# Altium schematic sheet mdriver.SchDoc: VNH5050 Motor Driver Circuit
size A4; ApprovedBy: Vincent Cayadi; CheckedBy: Vincent Cayadi; Author: Vincent Cayadi; CompanyName: Hwa Chong Institution; DrawnBy: Vincent Cayadi; Engineer: Vincent Cayadi; Organization: Sentinels Robotics; SheetNumber: 3; SheetTotal: 3
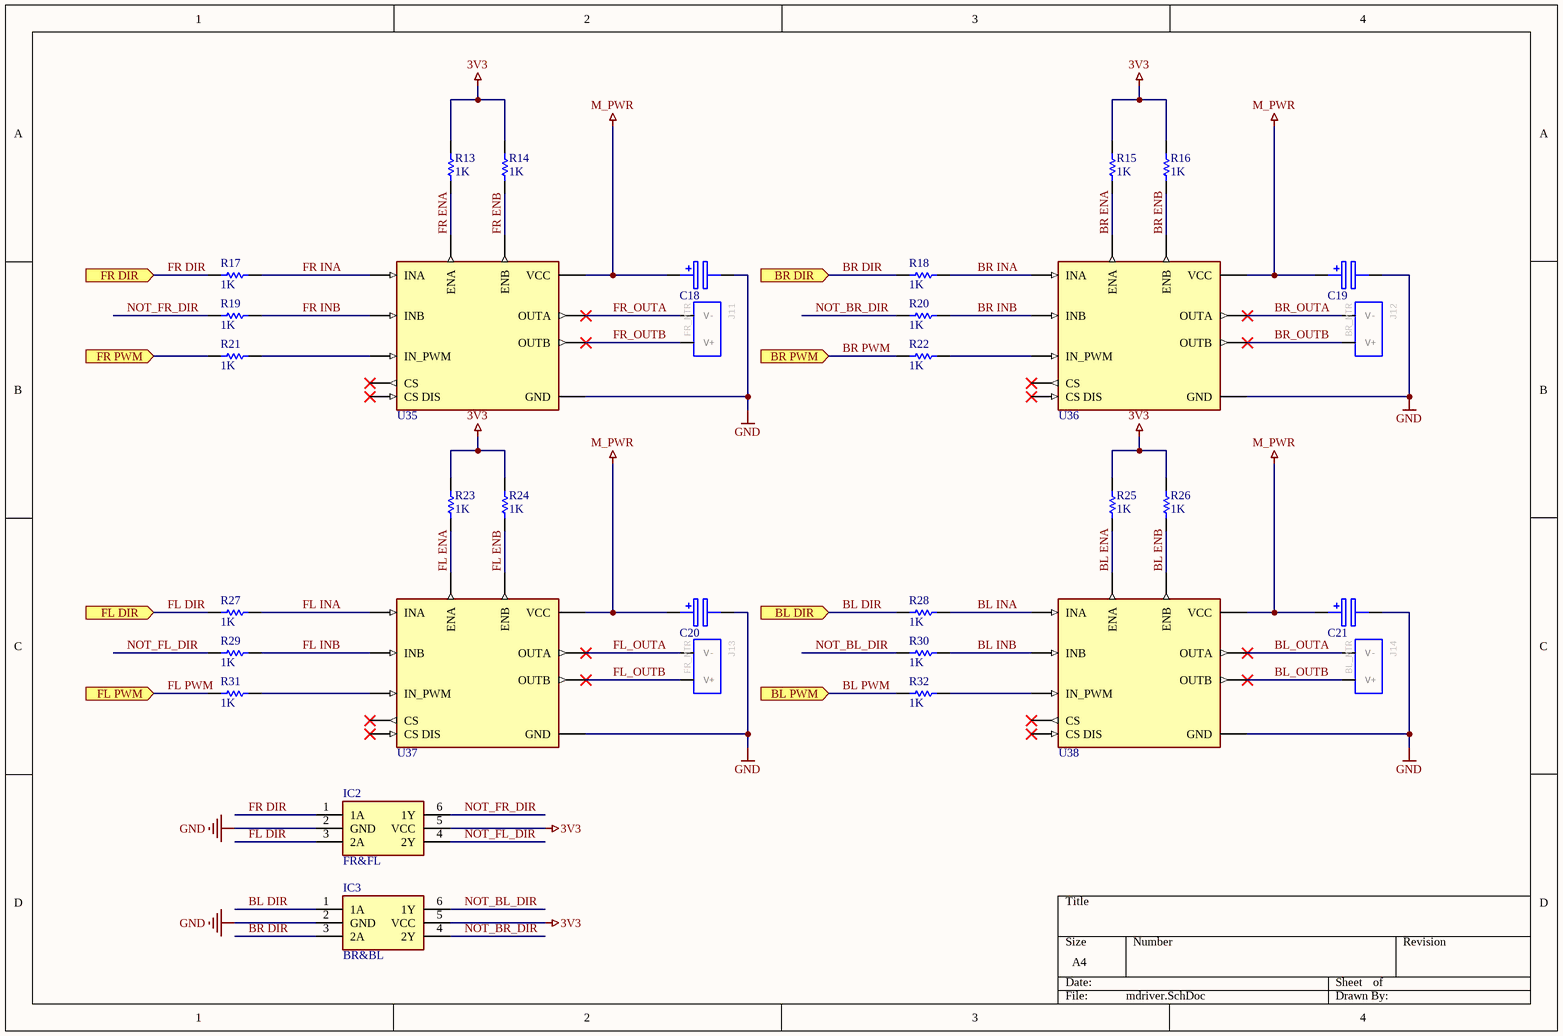
[diagram p0: mdriver.SchDoc]

## Parts
C18  47u  [EEE0JA331XP]  (value not drawn)
C19  47u  [EEE0JA331XP]  (value not drawn)
C20  47u  [EEE0JA331XP]  (value not drawn)
C21  47u  [EEE0JA331XP]  (value not drawn)
IC2  FR&FL  [SOT-23-6]
IC3  BR&BL  [SOT-23-6]
J11  FR_MTR  [XT30PB-F]
J12  BR_MTR  [XT30PB-F]
J13  FR_MTR  [XT30PB-F]
J14  BL_MTR  [XT30PB-F]
R13  1K  [RES0603]
R14  1K  [RES0603]
R15  1K  [RES0603]
R16  1K  [RES0603]
R17  1K  [RES0603]
R18  1K  [RES0603]
R19  1K  [RES0603]
R20  1K  [RES0603]
R21  1K  [RES0603]
R22  1K  [RES0603]
R23  1K  [RES0603]
R24  1K  [RES0603]
R25  1K  [RES0603]
R26  1K  [RES0603]
R27  1K  [RES0603]
R28  1K  [RES0603]
R29  1K  [RES0603]
R30  1K  [RES0603]
R31  1K  [RES0603]
R32  1K  [RES0603]
U35  FR  [SOP50P1030X247-39N]  (value not drawn)
U36  BR  [SOP50P1030X247-39N]  (value not drawn)
U37  FL  [SOP50P1030X247-39N]  (value not drawn)
U38  BL  [SOP50P1030X247-39N]  (value not drawn)

## Ports
BL DIR (in), BL PWM (in), BR DIR (in), BR PWM (in), FL DIR (in), FL PWM (in), FR DIR (in), FR PWM (in)

## Nets
3V3: IC2.5(VCC) IC3.5(VCC) R13.2 R14.2 R15.2 R16.2 R23.2 R24.2 R25.2 R26.2
GND: C18.2(-) C19.2(-) C20.2(-) C21.2(-) IC2.2(GND) IC3.2(GND) U35.GND U36.GND U37.GND U38.GND
M_PWR: C18.1(+) C19.1(+) C20.1(+) C21.1(+) U35.39(VCC) U36.39(VCC) U37.39(VCC) U38.39(VCC)
BL DIR: IC3.1(1A) R28.2 ; port BL DIR
BL ENA: R25.1 U38.16(ENA)
BL ENB: R26.1 U38.21(ENB)
BL INA: R28.1 U38.15(INA)
BL INB: R30.1 U38.22(INB)
BL PWM: R32.2 ; port BL PWM
BL_OUTA: J14.-(V-) U38.38(OUTA)
BL_OUTB: J14.+(V+) U38.37(OUTB)
BR DIR: IC3.3(2A) R18.2 ; port BR DIR
BR ENA: R15.1 U36.16(ENA)
BR ENB: R16.1 U36.21(ENB)
BR INA: R18.1 U36.15(INA)
BR INB: R20.1 U36.22(INB)
BR PWM: R22.2 ; port BR PWM
BR_OUTA: J12.-(V-) U36.38(OUTA)
BR_OUTB: J12.+(V+) U36.37(OUTB)
FL DIR: IC2.3(2A) R27.2 ; port FL DIR
FL ENA: R23.1 U37.16(ENA)
FL ENB: R24.1 U37.21(ENB)
FL INA: R27.1 U37.15(INA)
FL INB: R29.1 U37.22(INB)
FL PWM: R31.2 ; port FL PWM
FL_OUTA: J13.-(V-) U37.38(OUTA)
FL_OUTB: J13.+(V+) U37.37(OUTB)
FR DIR: IC2.1(1A) R17.2 ; port FR DIR
FR ENA: R13.1 U35.16(ENA)
FR ENB: R14.1 U35.21(ENB)
FR INA: R17.1 U35.15(INA)
FR INB: R19.1 U35.22(INB)
FR PWM: R21.2 ; port FR PWM
FR_OUTA: J11.-(V-) U35.38(OUTA)
FR_OUTB: J11.+(V+) U35.37(OUTB)
NOT_BL_DIR: IC3.6(1Y) R30.2
NOT_BR_DIR: IC3.4(2Y) R20.2
NOT_FL_DIR: IC2.4(2Y) R29.2
NOT_FR_DIR: IC2.6(1Y) R19.2
NetR21_1: R21.1 U35.17(IN_PWM)
NetR22_1: R22.1 U36.17(IN_PWM)
NetR31_1: R31.1 U37.17(IN_PWM)
NetR32_1: R32.1 U38.17(IN_PWM)

Not connected (* = marked no-connect by the designer): U35 CS* CS DIS*; U36 CS* CS DIS*; U37 CS* CS DIS*; U38 CS* CS DIS*

## Library data of the parts
C18-C21 = CMP-092-000001-4: Cap Aluminum Lytic 47uF 50V 20% (6.3 X 7.7mm) SMD 63mA 2000h 105C Automotive T/R; Manufacturer_Name: Panasonic; Height: 7.8mm; Mouser Part Number: 667-EEE-HBH470YAP; Arrow Part Number: EEE-HBH470YAP; Datasheet Link: http://industrial.panasonic.com/cdbs/www-data/pdf/RDE0000/ABA0000C1154.pdf; Manufacturer_Part_Number: EEE-HBH470YAP; Arrow Price/Stock: https://www.arrow.com/en/products/eee-hbh470yap/panasonic; Design Item ID: EEE-HBH470YAP; Source: SamacSys.SchLib; Mouser Price/Stock: https://www.mouser.com/Search/Refine.aspx?Keyword=667-EEE-HBH470YAP
IC2 IC3 = SN74LVC2G04DRLR: Integrated Circuit; Manufacturer_Name: Texas Instruments; Height: 0.6mm; Mouser Part Number: 595-SN74LVC2G04DRLR; Manufacturer_Part_Number: SN74LVC2G04DRLR; Datasheet Link: http://www.ti.com/lit/gpn/sn74lvc2g04; Mouser Price/Stock: https://www.mouser.co.uk/ProductDetail/Texas-Instruments/SN74LVC2G04DRLR?qs=pajgIaoyDUgGT9cUBVgEUw%3D%3D; Arrow Price/Stock: https://www.arrow.com/en/products/sn74lvc2g04drlr/texas-instruments?region=nac; Arrow Part Number: SN74LVC2G04DRLR
J11-J14 = XT30PB-F
R13-R32 = RES0603: Resistor
U35-U38 = VNH5050A-E: Motor Driver Power MOSFET Parallel, PWM PowerSSO-36; MF: STMicroelectronics; Availability: Unavailable; Source: SnapEDAsch.SchLib; Price: None; Value: *; Component Type: Standard; Pin Count: 62; MP: VNH5050A-E; SnapEDA_Link: https://www.snapeda.com/parts/VNH5050A-E/STMicroelectronics/view-part/490583/?ref=snap; Design Item ID: VNH5050A-E; Package: BFSOP-36 STMicroelectronics